# Altium schematic sheet COEX PDB schematics.SchDoc
size A4
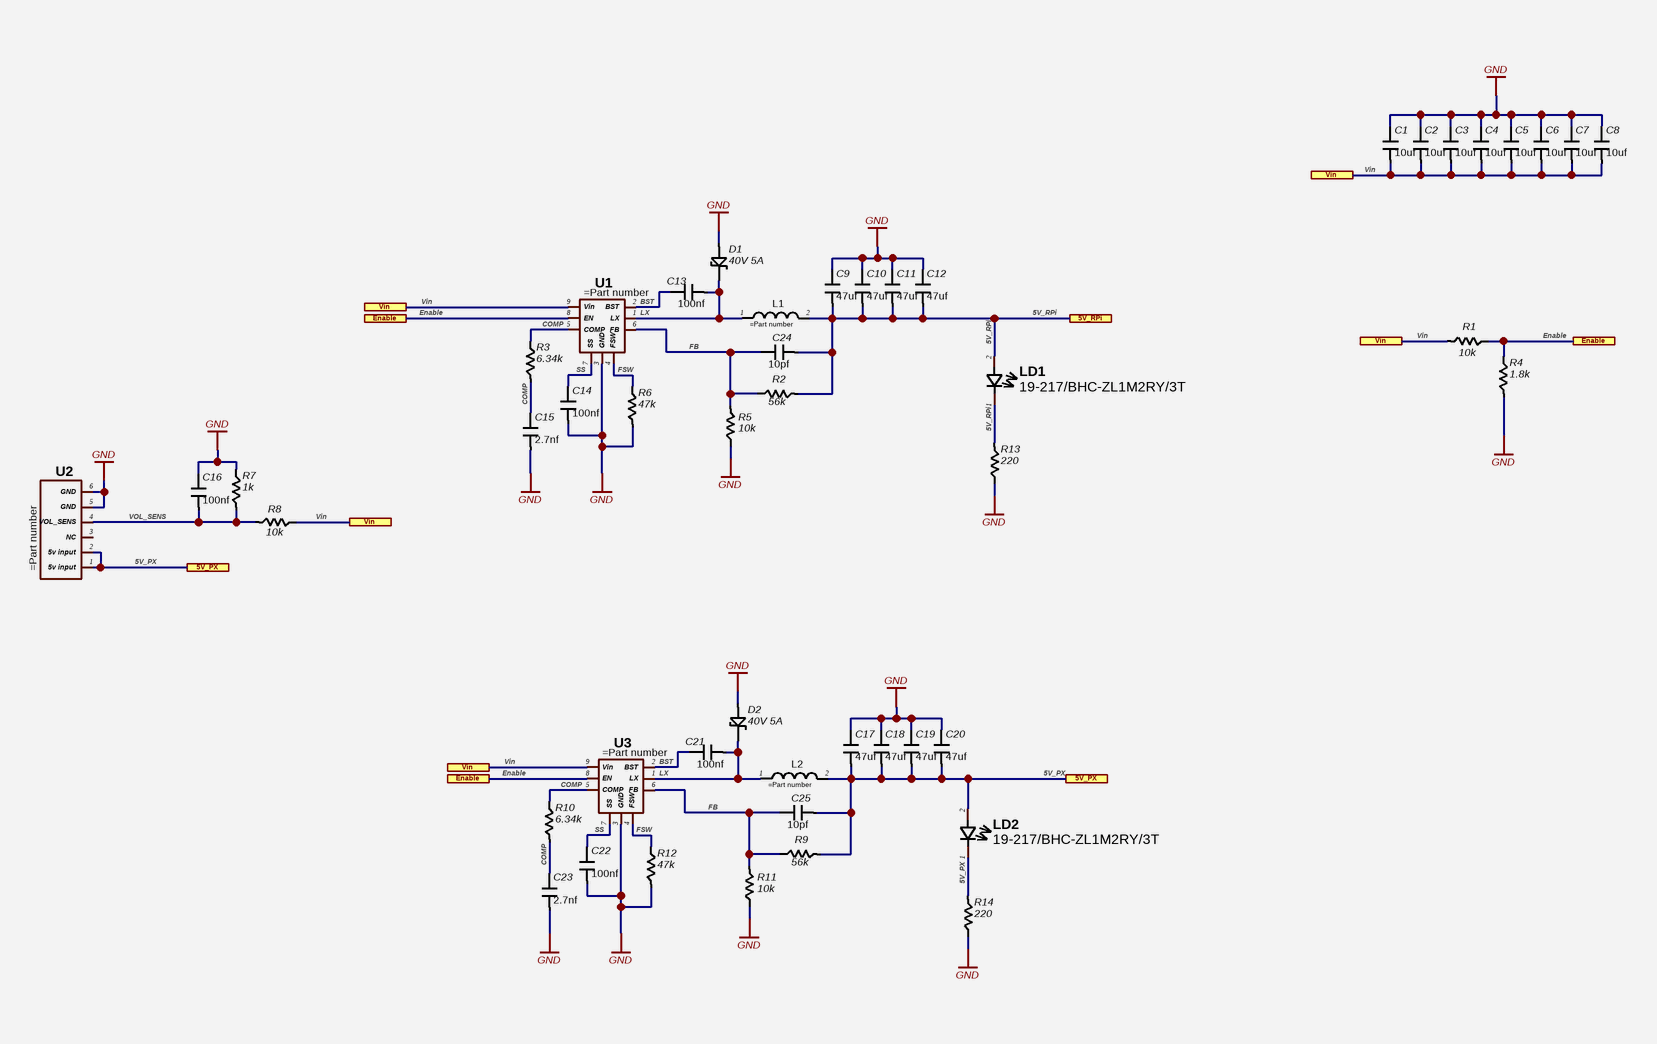
[diagram p0: COEX PDB schematics.SchDoc]

## Parts
C1  10uf  [Capasitor 0805]
C2  10uf  [Capasitor 0805]
C3  10uf  [Capasitor 0805]
C4  10uf  [Capasitor 0805]
C5  10uf  [Capasitor 0805]
C6  10uf  [Capasitor 0805]
C7  10uf  [Capasitor 0805]
C8  10uf  [Capasitor 0805]
C9  47uf  [Capasitor 0805]
C10  47uf  [Capasitor 0805]
C11  47uf  [Capasitor 0805]
C12  47uf  [Capasitor 0805]
C13  100nf  [Capasitor 0402]
C14  100nf  [Capasitor 0402]
C15  2.7nf  [Capasitor 0402]
C16  100nf  [Capasitor 0402]
C17  47uf  [Capasitor 0805]
C18  47uf  [Capasitor 0805]
C19  47uf  [Capasitor 0805]
C20  47uf  [Capasitor 0805]
C21  100nf  [Capasitor 0402]
C22  100nf  [Capasitor 0402]
C23  2.7nf  [Capasitor 0402]
C24  10pf  [Capasitor 0402]
C25  10pf  [Capasitor 0402]
D1  40V 5A  [SMAF]
D2  40V 5A  [SMAF]
L1  (no value)  [Inductor SMD 7.1x6.6]
L2  (no value)  [Inductor SMD 7.1x6.6]
LD1  19-217/BHC-ZL1M2RY/3T  [Led 0603]
LD2  19-217/BHC-ZL1M2RY/3T  [Led 0603]
R1  10k  [Resistor 0402]
R2  56k  [Resistor 0402]
R3  6.34k  [Resistor 0402]
R4  1.8k  [Resistor 0402]
R5  10k  [Resistor 0402]
R6  47k  [Resistor 0402]
R7  1k  [Resistor 0402]
R8  10k  [Resistor 0402]
R9  56k  [Resistor 0402]
R10  6.34k  [Resistor 0402]
R11  10k  [Resistor 0402]
R12  47k  [Resistor 0402]
R13  220  [Resistor 0402]
R14  220  [Resistor 0402]
U1  (no value)  [SOIC-8 (Thermal pad)]
U2  (no value)  [JST-GH 6 PIN]
U3  (no value)  [SOIC-8 (Thermal pad)]

## Ports
5V_PX, 5V_RPi, Enable, Vin

## Nets
GND: C1.1 C2.1 C3.1 C4.1 C5.1 C6.1 C7.1 C8.1 C9.1 C10.1 C11.1 C12.1 C14.2 C15.2 C16.1 C17.1 C18.1 C19.1 C20.1 C22.2 C23.2 D1.2 D2.2 R4.2 R5.1 R6.2 R7.1 R11.1 R12.2 R13.1 R14.1 U1.3(GND) U2.5(GND) U2.6(GND) U3.3(GND)
5V_PX: C17.2 C18.2 C19.2 C20.2 C25.2 L2.2 LD2.1 LD2.2 R9.2 R14.2 U2.1(5v_input) U2.2(5v_input) ; port 5V_PX
5V_RPi: C9.2 C10.2 C11.2 C12.2 C24.2 L1.2 LD1.1 LD1.2 R2.2 R13.2 ; port 5V_RPi
BST: C13.1 C21.1 U1.2(BST) U3.2(BST)
COMP: C15.1 C23.1 R3.1 R3.2 R10.1 R10.2 U1.5(COMP) U3.5(COMP)
Enable: R1.1 R4.1 U1.8(EN) U3.8(EN) ; port Enable
FB: C24.1 C25.1 R2.1 R5.2 R9.1 R11.2 U1.6(FB) U3.6(FB)
FSW: R6.1 R12.1 U1.4(FSW) U3.4(FSW)
LX: C13.2 C21.2 D1.1 D2.1 L1.1 L2.1 U1.1(LX) U3.1(LX)
SS: C14.1 C22.1 U1.7(SS) U3.7(SS)
Vin: C1.2 C2.2 C3.2 C4.2 C5.2 C6.2 C7.2 C8.2 R1.2 R8.1 U1.9(Vin) U3.9(Vin) ; port Vin
VOL_SENS: C16.2 R7.2 R8.2 U2.4(VOL_SENS)

Not connected (* = marked no-connect by the designer): U2 3(NC)

## Library data of the parts
C1-C8 = Capacitor MLCC: 10uF ±20% 35V X5R 0805 Multilayer Ceramic Capacitor; Partnumber: GRM21BR6YA106ME43L; Manufacturer: Murata Electronics; Component package: 0805; HelpURL: https://lcsc.com/product-detail/Multilayer-Ceramic-Capacitors-MLCC-SMD-SMT_Murata-Electronics-GRM21BR6YA106ME43L_C361063.html; Value: 10uf
C9-C12 C17-C20 = Capacitor MLCC: 47uF ±20% 6.3V X5R 0805 Multilayer Ceramic Capacitor; Partnumber: JMK212BJ476MG-T; Manufacturer: Taiyo Yuden; Component package: 0805; HelpURL: https://lcsc.com/product-detail/Multilayer-Ceramic-Capacitors-MLCC-SMD-SMT_TAIYO-YUDEN_JMK212BJ476MG-T_47uF-476-20-6-3V_C87159.html; Value: 47uf
C13 C14 C16 C21 C22 = Capacitor MLCC: 100nF ±10% 50V X5R 0402 Multilayer Ceramic Capacitor; Partnumber: CC0402KRX5R9BB104; Manufacturer: YAGEO; Component package: 0402; HelpURL: https://lcsc.com/product-detail/Multilayer-Ceramic-Capacitors-MLCC-SMD-SMT_100nF-104-10-50V_C105882.html; Value: 100nf
C15 C23 = Capacitor MLCC: 2.7nF ±10% 50V X7R 0402 Multilayer Ceramic Capacitor; Partnumber: CC0402KRX7R9BB272; Manufacturer: YAGEO; Component package: 0402; HelpURL: https://lcsc.com/product-detail/Multilayer-Ceramic-Capacitors-MLCC-SMD-SMT_2-7nF-272-10-50V_C106251.html; Value: 2.7nf
C24 C25 = Capacitor MLCC: 10pF ±5% 50V NP0 0402 Multilayer Ceramic Capacitor; Partnumber: CC0402JRNPO9BN100; Manufacturer: YAGEO; Component package: 0402; HelpURL: https://lcsc.com/product-detail/Multilayer-Ceramic-Capacitors-MLCC-SMD-SMT_10pF-100-5-50V_C106199.html; Value: 10pf
D1 D2 = Schottky barrier diode: 40V 5A 450mV @ 5A SMAF Schottky Barrier Diode; Partnumber: SL54F; Manufacturer: MDD(Microdiode Electronics); HelpURL: https://lcsc.com/product-detail/Schottky-Barrier-Diodes-SBD_MDD-Microdiode-Electronics-SL54F_C113939.html; Component package: SMAF; Value: 40V 5A
L1 L2 = FB / Inductor: 4.7uH ±20% 4.5A 45mΩ SMD,7.1x6.6x2.4mm Power Inductor; Partnumber: SLO0624H4R7MTT; Manufacturer: Sunltech Tech; HelpURL: https://lcsc.com/product-detail/Others_Sunltech-Tech-SLO0624H4R7MTT_C325975.html; Component package: SMD,7.1x6.6x2.4mm; Value: 4.7uh
LD1 LD2 = LED: Blue 465~475nm 0603 Light Emitting Diode; Manufacturer: Everlight Elec; Component package: 0603; Partnumber: 19-217/BHC-ZL1M2RY/3T; HelpURL: https://lcsc.com/product-detail/Light-Emitting-Diodes-LED_0603-Blue-light_C72041.html
R1 R5 R8 R11 = Resistor: Chip Resistor - Surface Mount 10KOhms ±1% 1/16W 0402; Partnumber: RC0402FR-0710KL; Manufacturer: YAGEO; Component package: 0402; HelpURL: https://lcsc.com/product-detail/Chip-Resistor-Surface-Mount_10KR-1002-1_C60490.html; Value: 10k
R2 R9 = Resistor: Chip Resistor - Surface Mount 56KOhms ±1% 1/16W 0402; Partnumber: RC0402FR-0756KL; Manufacturer: YAGEO; Component package: 0402; HelpURL: https://lcsc.com/product-detail/Chip-Resistor-Surface-Mount_56KR-5602-1_C114756.html; Value: 56k
R3 R10 = Resistor: 6.34K ±1% 1/16W ±100ppm/°C 0402 Chip Resistor; Partnumber: 0402WGF6341TCE; Manufacturer: UNI-ROYAL(Uniroyal Elec); Component package: 0402; HelpURL: https://lcsc.com/product-detail/Chip-Resistor-Surface-Mount_UNI-ROYAL-Uniroyal-Elec-0402WGF6341TCE_C45013.html; Value: 6.34k
R4 = Resistor: 1.8K ±1% 1/16W ±100ppm/°C 0402 Chip Resistor; Partnumber: RTT021801FTH; Manufacturer: RALEC; Component package: 0402; HelpURL: https://lcsc.com/product-detail/Chip-Resistor-Surface-Mount_1-8KR-1801-1_C102844.html; Value: 1.8k
R6 R12 = Resistor: 47K ±1% 1/16W ±100ppm/°C 0402 Chip Resistor; Partnumber: AC0402FR-0747KL; Manufacturer: YAGEO; Component package: 0402; HelpURL: https://lcsc.com/product-detail/Chip-Resistor-Surface-Mount_47KR-4702-1_C144757.html; Value: 47k
R7 = Resistor: 1K ±1% 1/16W ±100ppm/°C 0402 Chip Resistor; Partnumber: 0402WGF1001TCE; Manufacturer: UNI-ROYAL(Uniroyal Elec); Component package: 0402; HelpURL: https://lcsc.com/product-detail/Chip-Resistor-Surface-Mount_UNI-ROYAL-Uniroyal-Elec-0402WGF1001TCE_C11702.html; Value: 1k
R13 R14 = Resistor: 220 ±1% 1/16W ±200ppm/°C 0402 Chip Resistor; Partnumber: RC-02W2200FT; Manufacturer: FH(Guangdong Fenghua Advanced Tech); Component package: 0402; HelpURL: https://lcsc.com/product-detail/Chip-Resistor-Surface-Mount_FH-Guangdong-Fenghua-Advanced-Tech-RC-02W2200FT_C304587.html; Value: 220
U1 U3 = AOZ1284: Step-Down Positive Adjustable 1 4A 200kHz ~ 2MHz SOP-8_EP_150mil DC-DC Converter; Partnumber: AOZ1284PI; Manufacturer: Alpha & Omega Semicon; HelpURL: https://lcsc.com/product-detail/DC-DC-Converters_AOS_AOZ1284PI_AOZ1284PI_C48060.html; Component package: SOP-8_EP_150mil
U2 = JST-GH 6: GH Header Male Pin 0.049"(1.25mm) 6 SMD Wire To Board / Wire To Wire Connector; Partnumber: SM06B-GHS-TB(LF)(SN); Manufacturer: JST Sales America; HelpURL: https://lcsc.com/product-detail/Wire-To-Board-Wire-To-Wire-Connector_JST-Sales-America_SM06B-GHS-TB-LF-SN_JST-Sales-America-SM06B-GHS-TB-LF-SN_C133065.html